# Altium schematic sheet MCU.SchDoc
size A4; SheetNumber: 2; SheetTotal: 6
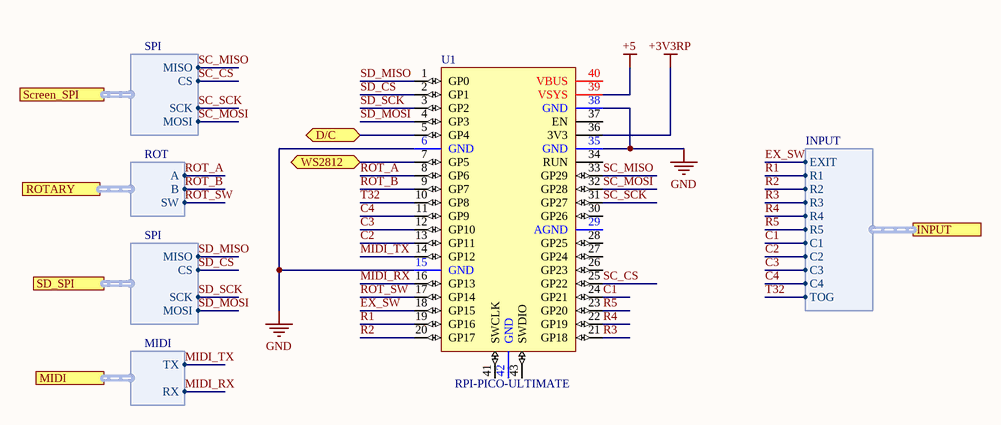
[diagram p0: MCU.SchDoc]

## Parts
U1  RPI-PICO-ULTIMATE  [SAMTEC SSW-110-03-T-S]

## Ports
D/C (bidir, see Main[2C], PERIPHERALS[2C]), INPUT (harness INPUT, see Main[2C], INPUT[1A]), MIDI (harness MIDI, see Main[2C], MIDI[2B]), ROTARY (harness ROT, see Main[2C], INPUT[1B]), Screen_SPI (harness SPI, see Main[2C], PERIPHERALS[1A]), SD_SPI (harness SPI, see Main[2C], PERIPHERALS[2A]), WS2812 (bidir, see Main[2C], OUTPUT[1A])

## Harnesses
SPI: MOSI, MISO, SCK, CS
ROT: A, B, SW
MIDI: TX, RX
INPUT: EXIT, R1, R2, R3, R4, R5, C1, C2, C3, C4, TOG

## Nets
+3V3RP: U1.36(3V3)
+5: U1.39(VSYS)
GND: U1.6(GND) U1.15(GND) U1.35(GND) U1.38(GND)
C1: U1.24(GP21) ; port INPUT.C1
C2: U1.13(GP11) ; port INPUT.C2
C3: U1.12(GP10) ; port INPUT.C3
C4: U1.11(GP9) ; port INPUT.C4
D/C: U1.5(GP4) ; port D/C
EX_SW: U1.18(GP15) ; port INPUT.EXIT
MIDI_RX: U1.16(GP13) ; port MIDI.RX
MIDI_TX: U1.14(GP12) ; port MIDI.TX
R1: U1.19(GP16) ; port INPUT.R1
R2: U1.20(GP17) ; port INPUT.R2
R3: U1.21(GP18) ; port INPUT.R3
R4: U1.22(GP19) ; port INPUT.R4
R5: U1.23(GP20) ; port INPUT.R5
ROT_A: U1.8(GP6) ; port ROTARY.A
ROT_B: U1.9(GP7) ; port ROTARY.B
ROT_SW: U1.17(GP14) ; port ROTARY.SW
SC_CS: U1.25(GP22) ; port Screen_SPI.CS
SC_MISO: U1.33(GP29) ; port Screen_SPI.MISO
SC_MOSI: U1.32(GP28) ; port Screen_SPI.MOSI
SC_SCK: U1.31(GP27) ; port Screen_SPI.SCK
SD_CS: U1.2(GP1) ; port SD_SPI.CS
SD_MISO: U1.1(GP0) ; port SD_SPI.MISO
SD_MOSI: U1.4(GP3) ; port SD_SPI.MOSI
SD_SCK: U1.3(GP2) ; port SD_SPI.SCK
T32: U1.10(GP8) ; port INPUT.TOG
WS2812: U1.7(GP5) ; port WS2812

Not connected (* = marked no-connect by the designer): U1 26(GP23) 27(GP24) 28(GP25) 29(AGND) 30(GP26) 34(RUN) 37(EN) 40(VBUS) 41(SWCLK) 42(GND) 43(SWDIO)

## Library data of the parts
U1 = RPI-PICO-MOD_SM: RASPBERRY PI PICO RP2040 BOARD NO TEST PADS; Manufacturer: Raspberry Pi Foundation; Manufacturer Part No: SC0915; Mounting Technology: SMT; Supplier: DigiKey; Supplier Part No: 2648-SC0915CT-ND; Supplier Link: https://www.digikey.com/en/products/detail/raspberry-pi/SC0915/13684020